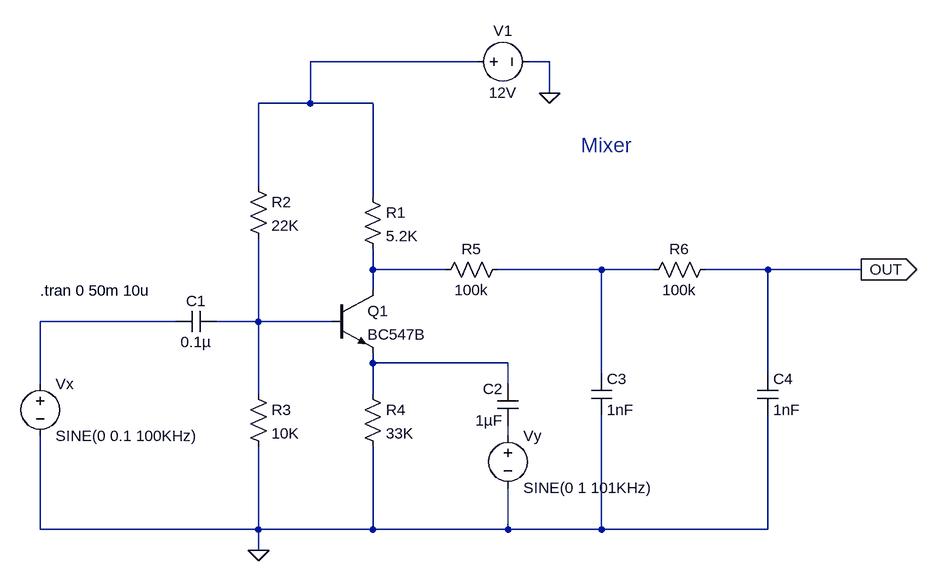
[diagram p0: schematic addative_mixer.asc]
addative_mixer.asc, the LTspice schematic file:
Version 4
SHEET 1 1132 680
WIRE 432 -224 176 -224
WIRE 544 -224 512 -224
WIRE 544 -176 544 -224
WIRE 176 -160 176 -224
WIRE 176 -160 96 -160
WIRE 272 -160 176 -160
WIRE 96 -32 96 -160
WIRE 272 -16 272 -160
WIRE 272 96 272 64
WIRE 384 96 272 96
WIRE 624 96 464 96
WIRE 704 96 624 96
WIRE 880 96 784 96
WIRE 1024 96 880 96
WIRE 272 128 272 96
WIRE -32 176 -240 176
WIRE 96 176 96 48
WIRE 96 176 32 176
WIRE 208 176 96 176
WIRE 272 240 272 224
WIRE 480 240 272 240
WIRE 624 256 624 96
WIRE 880 256 880 96
WIRE -240 272 -240 176
WIRE 480 272 480 240
WIRE 96 288 96 176
WIRE 272 288 272 240
WIRE 480 352 480 336
WIRE -240 496 -240 352
WIRE 96 496 96 368
WIRE 96 496 -240 496
WIRE 272 496 272 368
WIRE 272 496 96 496
WIRE 480 496 480 432
WIRE 480 496 272 496
WIRE 624 496 624 320
WIRE 624 496 480 496
WIRE 880 496 880 320
WIRE 880 496 624 496
WIRE 96 528 96 496
FLAG 96 528 0
FLAG 544 -176 0
FLAG 1024 96 OUT
IOPIN 1024 96 Out
SYMBOL npn 208 128 R0
SYMATTR InstName Q1
SYMATTR Value BC547B
SYMBOL res 256 -32 R0
SYMATTR InstName R1
SYMATTR Value 5.2K
SYMBOL res 80 -48 R0
SYMATTR InstName R2
SYMATTR Value 22K
SYMBOL res 80 272 R0
SYMATTR InstName R3
SYMATTR Value 10K
SYMBOL res 256 272 R0
SYMATTR InstName R4
SYMATTR Value 33K
SYMBOL res 480 80 R90
WINDOW 0 0 56 VBottom 2
WINDOW 3 32 56 VTop 2
SYMATTR InstName R5
SYMATTR Value 100k
SYMBOL res 800 80 R90
WINDOW 0 0 56 VBottom 2
WINDOW 3 32 56 VTop 2
SYMATTR InstName R6
SYMATTR Value 100k
SYMBOL voltage -240 256 R0
WINDOW 123 0 0 Left 0
WINDOW 39 0 0 Left 0
SYMATTR InstName Vx
SYMATTR Value SINE(0 0.1 100KHz)
SYMBOL cap 32 160 R90
WINDOW 0 0 32 VBottom 2
WINDOW 3 32 32 VTop 2
SYMATTR InstName C1
SYMATTR Value 0.1µ
SYMBOL cap 496 336 R180
WINDOW 0 24 56 Left 2
WINDOW 3 24 8 Left 2
SYMATTR InstName C2
SYMATTR Value 1µF
SYMBOL voltage 480 336 R0
WINDOW 123 0 0 Left 0
WINDOW 39 0 0 Left 0
SYMATTR InstName Vy
SYMATTR Value SINE(0 1 101KHz)
SYMBOL cap 608 256 R0
SYMATTR InstName C3
SYMATTR Value 1nF
SYMBOL cap 864 256 R0
SYMATTR InstName C4
SYMATTR Value 1nF
SYMBOL voltage 416 -224 R270
WINDOW 0 32 56 VTop 2
WINDOW 3 -32 56 VBottom 2
WINDOW 123 0 0 Left 0
WINDOW 39 0 0 Left 0
SYMATTR InstName V1
SYMATTR Value 12V
TEXT -240 128 Left 2 !.tran 0 50m 10u
TEXT 592 -96 Left 3 ;Mixer

The netlist it stands for:
* addative_mixer.asc
Q1 N002 N005 N006 0 BC547B
R1 N001 N002 5.2K
R2 N001 N005 22K
R3 N005 0 10K
R4 N006 0 33K
R5 N003 N002 100k
R6 OUT N003 100k
Vx N004 0 SINE(0 0.1 100KHz)
C1 N005 N004 0.1µ
C2 N007 N006 1µF
Vy N007 0 SINE(0 1 101KHz)
C3 N003 0 1nF
C4 OUT 0 1nF
V1 N001 0 12V
.model NPN NPN
.model PNP PNP
.lib standard.bjt
.tran 0 50m 10u
* Mixer
.backanno
.end